# EAGLE design HoverGames_v2 (EAGLE 8.3.2)
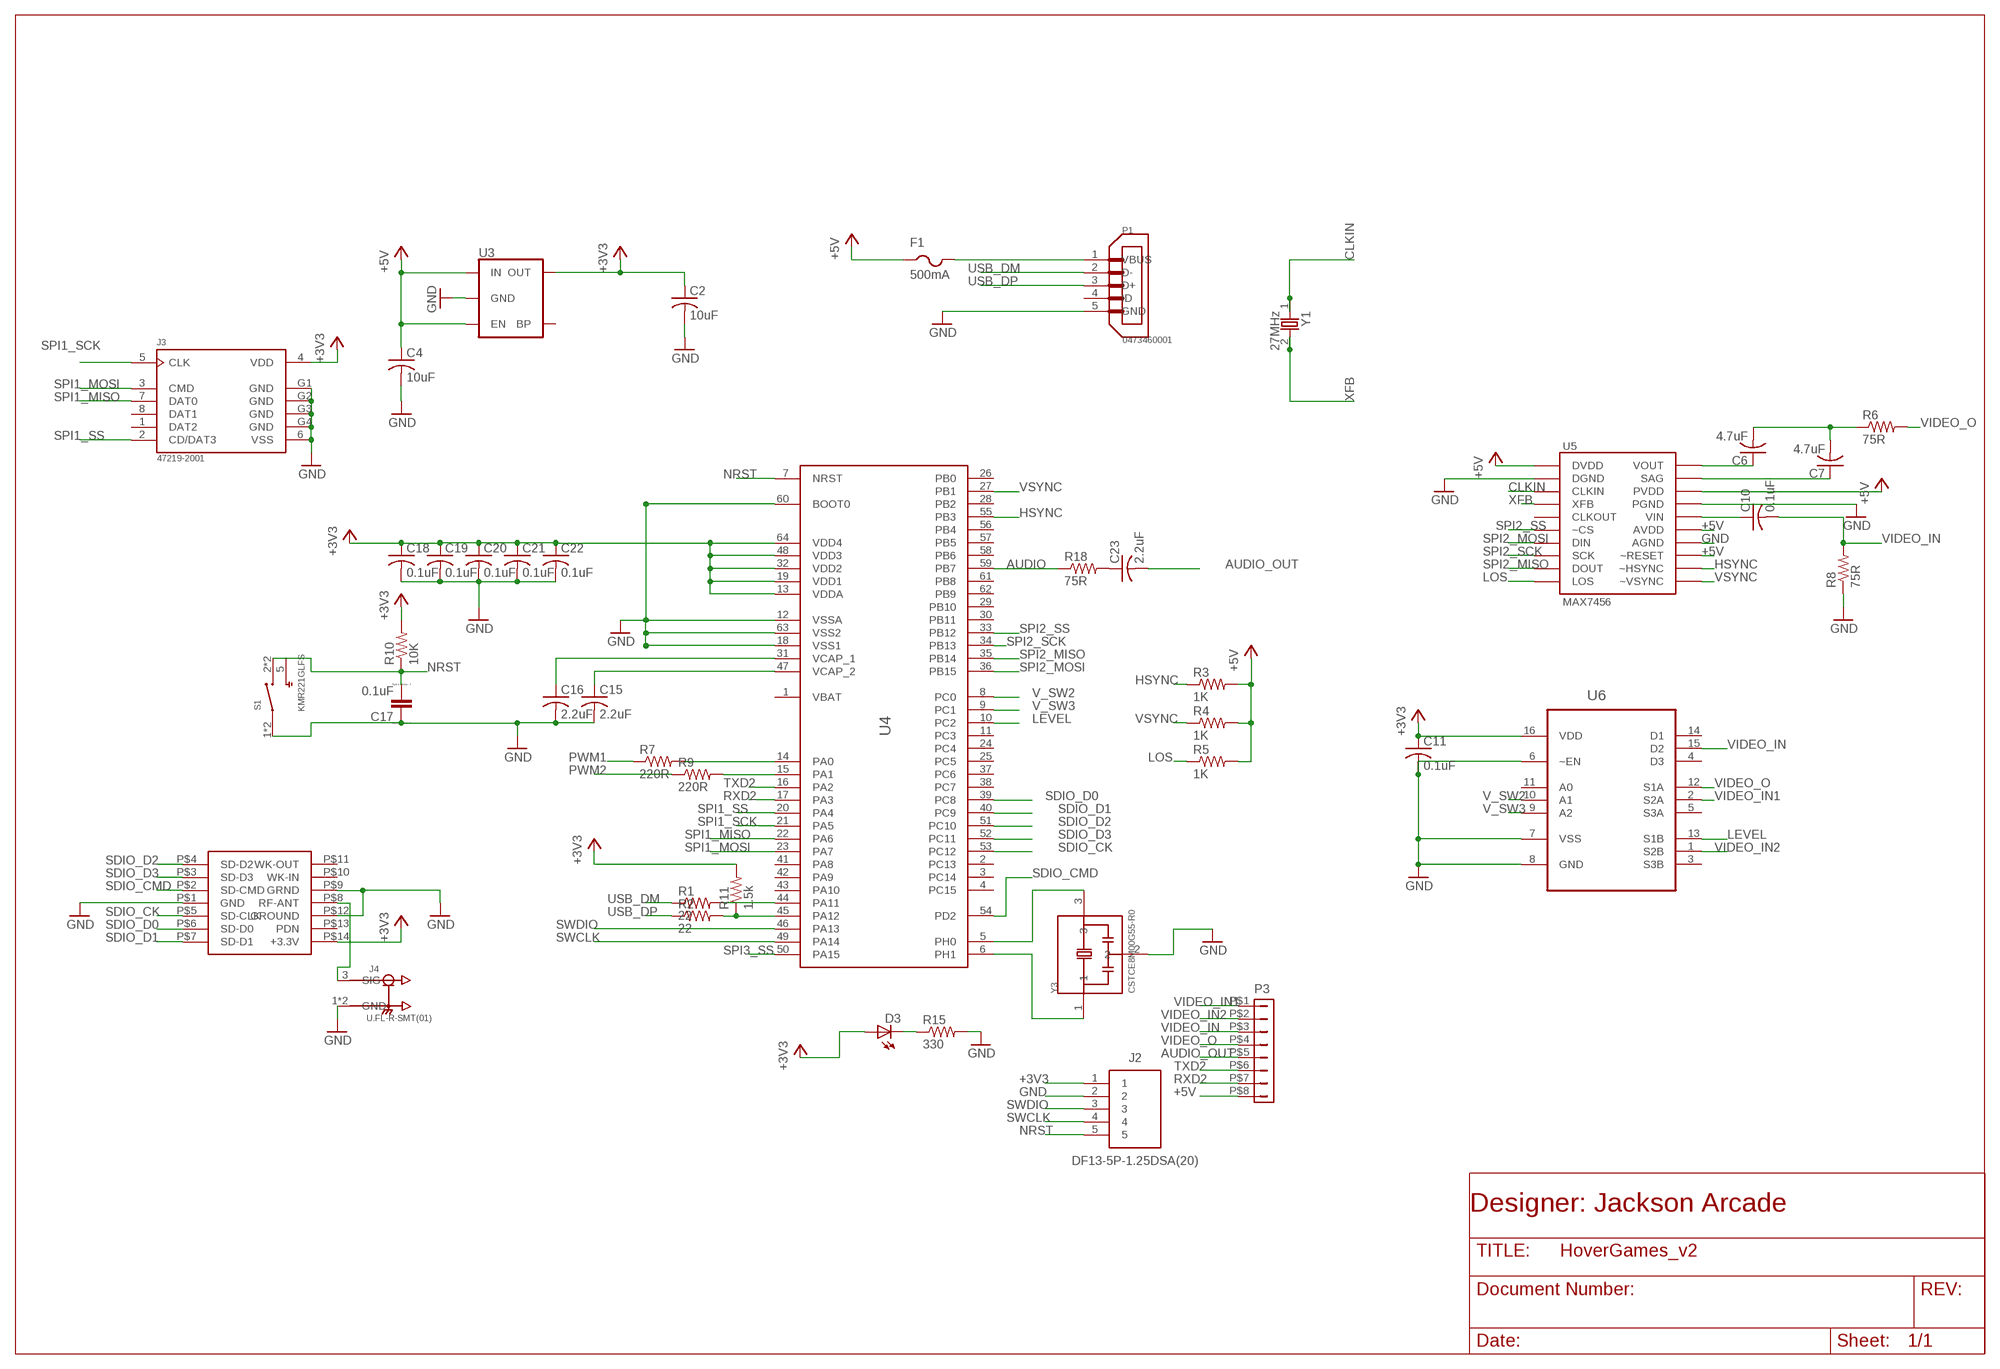
[diagram p0: schematic, sheet 1]

## Parts
C2  10uF  C-USC0402  [C0402]
C4  10uF  C-USC0402  [C0402]
C6  4.7uF  C-USC0402  [C0402]
C7  4.7uF  C-USC0402  [C0402]
C10  0.1uF  C-USC0402  [C0402]
C11  0.1uF  C-USC0402  [C0402]
C15  2.2uF  C-USC0603  [C0603]
C16  2.2uF  C-USC0603  [C0603]
C17  0.1uF  CC0402  [C0402]
C18  0.1uF  C-USC0402  [C0402]
C19  0.1uF  C-USC0402  [C0402]
C20  0.1uF  C-USC0402  [C0402]
C21  0.1uF  C-USC0402  [C0402]
C22  0.1uF  C-USC0402  [C0402]
C23  2.2uF  C-USC0603  [C0603]
D3  LEDCHIP-LED0603  [CHIP-LED0603]
F1  500mA  PTCFUSE-1206  [R1206]
J2  DF13-5P-1.25DSA(20)  [SHDR5W43P0X125_1X5_790X340X460]
J3  47219-2001  [MOLEX_47219-2001]
J4  U.FL-R-SMT(01)  [HRS_U.FL-R-SMT(01)]
P1  0473460001  [MOLEX_0473460001]
P3  DF13-8P-1.25DSA  [DF13-8P-1.25DSA]
R1  22  R-US_R0402  [R0402]
R2  22  R-US_R0402  [R0402]
R3  1K  R-US_R0402  [R0402]
R4  1K  R-US_R0402  [R0402]
R5  1K  R-US_R0402  [R0402]
R6  75R  R-US_R0402  [R0402]
R7  220R  R-US_R0402  [R0402]
R8  75R  R-US_R0402  [R0402]
R9  220R  R-US_R0402  [R0402]
R10  10K  R-US_R0402  [R0402]
R11  1.5k  R-US_R0402  [R0402]
R15  330  R-US_R0402  [R0402]
R18  75R  R-US_R0402  [R0402]
S1  KMR221GLFS  [SW_KMR221GLFS]
U3  V_REG_SPX3819-SOT23-5  [SOT23-5]
U4  STM32F405XXSTM32F405XX  [LQFP64]
U5  MAX7456  [TSSOP28]
U6  ADG733BRUZ  [SOP65P640X120-16N]
U7  88W8801  [88W8801]
Y1  27MHz  ABM3-27.000MHZ-B2-T  [XTAL500X320X130N]
Y3  CSTCE8M00G55-R0  [OSC_CSTCE8M00G55-R0]

## Nets
+3V3: C2.1 C11.1 C18.1 C19.1 C20.1 C21.1 C22.1 D3.A J2.1 J3.4(VDD) R10.2 R11.2 U3.5(OUT) U4.13(VDDA) U4.19(VDD1) U4.32(VDD2) U4.48(VDD3) U4.64(VDD4) U6.16(VDD) U7.P$14(+3.3V)
+5V: C4.1 F1.1 P3.P$8 R3.2 R4.2 R5.2 U3.1(IN) U3.3(EN) U5.3(DVDD) U5.19(~RESET) U5.21(AVDD) U5.24(PVDD)
AUDIO: R18.1 U4.59(PB7)
AUDIO_OUT: C23.2 P3.P$5
CLKIN: U5.5(CLKIN) Y1.1
GND: C2.2 C4.2 C11.2 C15.2 C16.2 C17.1 C18.2 C19.2 C20.2 C21.2 C22.2 J2.2 J3.6(VSS) J3.G1(GND) J3.G2(GND) J3.G3(GND) J3.G4(GND) J4.1(GND) J4.2(GND) P1.5(GND) R8.1 R15.2 S1.1 S1.4 U3.2(GND) U4.12(VSSA) U4.18(VSS1) U4.60(BOOT0) U4.63(VSS2) U5.4(DGND) U5.20(AGND) U5.23(PGND) U6.6(~EN) U6.7(VSS) U6.8(GND) U7.P$1(GND) U7.P$9(GRND) U7.P$12(GROUND) Y3.2
HSYNC: R3.1 U4.55(PB3) U5.18(~HSYNC)
LEVEL: U4.10(PC2) U6.13(S1B)
LOS: R5.1 U5.12(LOS)
N$1: R7.2 U4.14(PA0)
N$2: R9.2 U4.15(PA1)
N$4: C23.1 R18.2
N$5: J4.3(SIG) U7.P$8(RF-ANT)
N$6: C16.1 U4.31(VCAP_1)
N$7: R1.2 U4.44(PA11)
N$8: C15.1 U4.47(VCAP_2)
N$9: R2.2 R11.1 U4.45(PA12)
N$12: C6.1 U5.26(VOUT)
N$13: C7.1 U5.25(SAG)
N$14: C6.2 C7.2 R6.1
N$15: C10.1 U5.22(VIN)
N$16: F1.2 P1.1(VBUS)
N$17: U4.6(PH1) Y3.1
N$18: D3.C R15.1
N$20: U4.5(PH0) Y3.3
NRST: C17.2 J2.5 R10.1 S1.2 S1.3 U4.7(NRST)
PWM1: R7.1
PWM2: R9.1
RXD2: P3.P$7 U4.17(PA3)
SDIO_CK: U4.53(PC12) U7.P$5(SD-CLK)
SDIO_CMD: U4.54(PD2) U7.P$2(SD-CMD)
SDIO_D0: U4.39(PC8) U7.P$6(SD-D0)
SDIO_D1: U4.40(PC9) U7.P$7(SD-D1)
SDIO_D2: U4.51(PC10) U7.P$4(SD-D2)
SDIO_D3: U4.52(PC11) U7.P$3(SD-D3)
SPI1_MISO: J3.7(DAT0) U4.22(PA6)
SPI1_MOSI: J3.3(CMD) U4.23(PA7)
SPI1_SCK: J3.5(CLK) U4.21(PA5)
SPI1_SS: J3.2(CD/DAT3) U4.20(PA4)
SPI2_MISO: U4.35(PB14) U5.11(DOUT)
SPI2_MOSI: U4.36(PB15) U5.9(DIN)
SPI2_SCK: U4.34(PB13) U5.10(SCK)
SPI2_SS: U4.33(PB12) U5.8(~CS)
SPI3_SS: U4.50(PA15)
SWCLK: J2.4 U4.49(PA14)
SWDIO: J2.3 U4.46(PA13)
TXD2: P3.P$6 U4.16(PA2)
USB_DM: P1.2(D-) R1.1
USB_DP: P1.3(D+) R2.1
V_SW2: U4.8(PC0) U6.10(A1)
V_SW3: U4.9(PC1) U6.9(A2)
VIDEO_IN: C10.2 P3.P$3 R8.2 U6.15(D2)
VIDEO_IN1: P3.P$1 U6.2(S2A)
VIDEO_IN2: P3.P$2 U6.1(S2B)
VIDEO_O: P3.P$4 R6.2 U6.12(S1A)
VSYNC: R4.1 U4.27(PB1) U5.17(~VSYNC)
XFB: U5.6(XFB) Y1.2
Unconnected: J3.1(DAT2) J3.8(DAT1) P1.4(ID) S1.5 U3.4(BP) U4.2(PC13) U4.3(PC14) U4.4(PC15) U4.11(PC3) U4.24(PC4) U4.25(PC5) U4.26(PB0) U4.28(PB2) U4.29(PB10) U4.30(PB11) U4.37(PC6) U4.38(PC7) U4.41(PA8) U4.42(PA9) U4.43(PA10) U4.56(PB4) U4.57(PB5) U4.58(PB6) U4.61(PB8) U4.62(PB9) U5.7(CLKOUT) U6.3(S3B) U6.4(D3) U6.5(S3A) U6.11(A0) U6.14(D1) U7.P$10(WK-IN) U7.P$11(WK-OUT) U7.P$13(PDN)

## Notes on the sheet
- Designer: Jackson Arcade

## Power pins joined to a net without a drawn wire
VBAT: U4.1(VBAT)

## Library data of the parts
C2 C4 C6 C7 C11 C15 C16 C18-C23 = rcl:C-US: CAPACITOR, American symbol
C10 = resistor:C-US: CAPACITOR, American symbol
C17 = eagle-ltspice:C: CAPACITOR, European symbol; SPICEMODEL: NONE; SPICEPREFIX: C
D3 = adafruit:LED: LED OSRAM: - CHIPLED LG R971, LG N971, LY N971, LG Q971, LY Q971, LO R971, LY R971 LH N974, LH R974 LS Q976, LO Q976, LY Q976 LO Q996 - Hyper CHIPLED LW Q18S LB Q993, LB Q99A, LB R99A - SideLED LS A670, LO A670, LY A670, LG A670, LP A670 LB A673, LV A673, LT A673, LW A673 LH A674 LY A675 LS A676, LA A676, LO A676, LY A676, LW A676 LS A679, LY A679, LG A679 - Hyper Micro SIDELED® LS Y876, LA Y876, LO Y876, LY Y876 LT Y87S - SmartLED LW L88C, LW L88S LB L89C, LB L89S, LG L890 LS L89K, LO L89K, LY L89K LS L896, LA L896, LO L896, LY L896 - TOPLED LS T670, LO T670, LY T670, LG T670, LP T670 LSG T670, LSP T670, LSY T670, LOP T670, LYG T670 LG T671, LOG T671, LSG T671 LB T673, LV T673, LT T673, LW T673 LH T674 LS T676, LA T676, LO T676, LY T676, LB T676, LH T676, LSB T676, LW T676 LB T67C, LV T67C, LT T67C, LS T67K, LO T67K, LY T67K, LW E67C LS E67B, LA E67B, LO E67B, LY E67B, LB E67C, LV E67C, LT E67C LW T67C LS T679, LY T679, LG T679 LS T770, LO T770, LY T770, LG T770, LP T770 LB T773, LV T773, LT T773, LW T773 LH T774 LS E675, LA E675, LY E675, LS T675 LS T776, LA T776, LO T776, LY T776, LB T776 LHGB T686 LT T68C, LB T68C - Hyper Mini TOPLED® LB M676 - Mini TOPLED Santana® LG M470 LS M47K, LO M47K, LY M47K Source: http://www.osram.convergy.de/
F1 = adafruit:PTCFUSE: PTC fuses, resettable thermistors
J2 = DF13-5P-1.25DSA(20):DF13-5P-1.25DSA(20): Hirose DF13 Series, 1.25mm Pitch 5 Way 1 Row Straight PCB Header, Solder Termination, 1A <https://componentsearchengine.com/Images/3/DF13-5P-1.25DSA%2820%29.jpg> Source: Datasheet <https://www.hirose.com/product/en/download_file/key_name/DF13-5P-1.25DSA(20)/category/Drawing (2D)/doc_file_id/38127/?file_category_id=6&item_id=05360104720&is_series=>; DESCRIPTION: Hirose DF13 Series, 1.25mm Pitch 5 Way 1 Row Straight PCB Header, Solder Termination, 1A; HEIGHT: 4.6mm; MANUFACTURER_NAME: Hirose; MANUFACTURER_PART_NUMBER: DF13-5P-1.25DSA(20); RS_PART_NUMBER: 5037912P; SUPPLIER_NAME: RS
J3 = 47219-2001:47219-2001: 1.10mm Pitch microSD Card Connector, Hinge Type, Lead-Free http://www.snapeda.com/parts/47219-2001/Molex%20/%20Waldom/view-part/#; AVAILABILITY: Good; DESCRIPTION: Conn Micro SD Card SKT 8 POS 1.1mm Solder RA SMD 0.5A/Contact Embossed T/R; MF: Molex; MP: 47219-2001; PACKAGE: None; PRICE: 0.62 USD
J4 = U.FL-R-SMT_01_:U.FL-R-SMT(01): U.FL Series 6 Ghz 50 Ohm Ultra-small SMT Coaxial Cable Receptacle; AVAILABILITY: Good; DESCRIPTION: U.FL Series 6 Ghz 50 Ohm Ultra-small SMT Coaxial Cable Receptacle; MF: Hirose; MP: U.FL-R-SMT(01); PACKAGE: None; PRICE: 0.82 USD
P1 = 0473460001:0473460001: Conn Micro USB Type B RCP 5 POS 0.65mm Solder RA SMD 5 Terminal 1 Port T/R; AVAILABILITY: Good; DESCRIPTION: DEK 5 FW 1-50. Terminal markers, Card, 5 x 5 mm, Polyamide, Colour: White GTIN (EAN): 4008190135157; MF: Weidmuller; MP: 0473460001; PACKAGE: None; PRICE: 2.87 USD
P3 = con-hirose-df13:DF13-8P-1.25: DF13-8P 1.25mm Pitch Miniature Crimping Connector.
R1-R7 R9-R11 R15 R18 = rcl:R-US_: RESISTOR, American symbol
R8 = resistor:R-US_: RESISTOR, American symbol
S1 = KMR221GLFS:KMR221GLFS: Switch Tactile N.O. SPST Button Gull Wing 0.05A 32VDC 1VA 200000Cycles 2N SMD Automotive T/R; AVAILABILITY: Good; DESCRIPTION: Switch Tactile N.O. SPST Button Gull Wing 0.05A 32VDC 1VA 200000Cycles 2N SMD Automotive T/R; MF: C&K Components; MP: KMR221GLFS; PACKAGE: None; PRICE: 0.27 USD
U3 = SparkFun-IC-Power:V_REG_SPX3819: SPX3819 Voltage Regulator 3.3V 500mA, 16V input Datasheet <https://www.exar.com/content/document.ashx?id=22106> SparkFun Products: SparkFun Serial Controlled Motor Driver <https://www.sparkfun.com/products/13911>; PROD_ID: VREG-13321; VALUE: SPX3819M5_3_3
U4 = stm32f:STM32F405XX: Features • Core: ARM 32-bit Cortex™-M4 CPU with FPU, Adaptive real-time accelerator (ART Accelerator™) allowing 0-wait state execution from Flash memory, frequency up to 168 MHz, memory protection unit, 210 DMIPS/ 1.25 DMIPS/MHz (Dhrystone 2.1), and DSP instructions • Memories – Up to 1 Mbyte of Flash memory – Up to 192+4 Kbytes of SRAM including 64- Kbyte of CCM (core coupled memory) data RAM – Flexible static memory controller supporting Compact Flash, SRAM, PSRAM, NOR and NAND memories • LCD parallel interface, 8080/6800 modes • Clock, reset and supply management – 1.8 V to 3.6 V application supply and I/Os – POR, PDR, PVD and BOR – 4-to-26 MHz crystal oscillator – Internal 16 MHz factory-trimmed RC (1% accuracy) – 32 kHz oscillator for RTC with calibration – Internal 32 kHz RC with calibration • Low power – Sleep, Stop and Standby modes – VBAT supply for RTC, 20×32 bit backup registers + optional 4 KB backup SRAM • 3×12-bit, 2.4 MSPS A/D converters: up to 24 channels and 7.2 MSPS in triple interleaved mode • 2×12-bit D/A converters • General-purpose DMA: 16-stream DMA controller with FIFOs and burst support • Up to 17 timers: up to twelve 16-bit and two 32- bit timers up to 168 MHz, each with up to 4 IC/OC/PWM or pulse counter and quadrature (incremental) encoder input • Debug mode – Serial wire debug (SWD) & JTAG interfaces – Cortex-M4 Embedded Trace Macrocell™ • Up to 140 I/O ports with interrupt capability – Up to 136 fast I/Os up to 84 MHz – Up to 138 5 V-tolerant I/Os • Up to 15 communication interfaces – Up to 3 × I2C interfaces (SMBus/PMBus) – Up to 4 USARTs/2 UARTs (10.5 Mbit/s, ISO 7816 interface, LIN, IrDA, modem control) – Up to 3 SPIs (42 Mbits/s), 2 with muxed full-duplex I2S to achieve audio class accuracy via internal audio PLL or external clock – 2 × CAN interfaces (2.0B Active) – SDIO interface • Advanced connectivity – USB 2.0 full-speed device/host/OTG controller with on-chip PHY – USB 2.0 high-speed/full-speed device/host/OTG controller with dedicated DMA, on-chip full-speed PHY and ULPI – 10/100 Ethernet MAC with dedicated DMA: supports IEEE 1588v2 hardware, MII/RMII • 8- to 14-bit parallel camera interface up to 54 Mbytes/s • True random number generator • CRC calculation unit • 96-bit unique ID • RTC: subsecond accuracy, hardware calendar
U5 = SparkFun-Retired:MAX7456: Monochrome NTSC/PAL on-screen display generator (SPI)
U6 = Analog Devices_By_element14_Batch_1:ADG733BRUZ: SPDT Switches; MPN: ADG733BRUZ; OC_FARNELL: 1699597; OC_NEWARK: 59K1571; PACKAGE: TSSOP-16; SUPPLIER: ANALOG DEVICES
U7 = 88w8801:88W8801
Y1 = ABM3-27.000MHZ-B2-T:ABM3-27.000MHZ-B2-T: Crystals 12MHz 18pF 30ppm -40C +85C; AVAILABILITY: Good; DESCRIPTION: Crystal 27MHz ?Ø¢Â±20ppm (Tol) ?Ø¢Â±50ppm (Stability) 18pF FUND 50Ohm 2-Pin CSMD T/R; MF: Abracon; MP: ABM3-27.000MHZ-B2-T; PACKAGE: SMD-2 Abracon; PRICE: 0.59 USD
Y3 = CSTCE8M00G55-R0:CSTCE8M00G55-R0: SMD Crystal 8MHz -0.3%-150R; AVAILABILITY: Good; DESCRIPTION: Ceramic Resonator 8MHz ??0.5% (Tol) ??0.2% (Stability) 33pF 40Ohm 3-Pin CSMD T/R; MF: Murata; MP: CSTCE8M00G55-R0; PACKAGE: SMD-3 Murata; PRICE: 0.27 USD

## Board
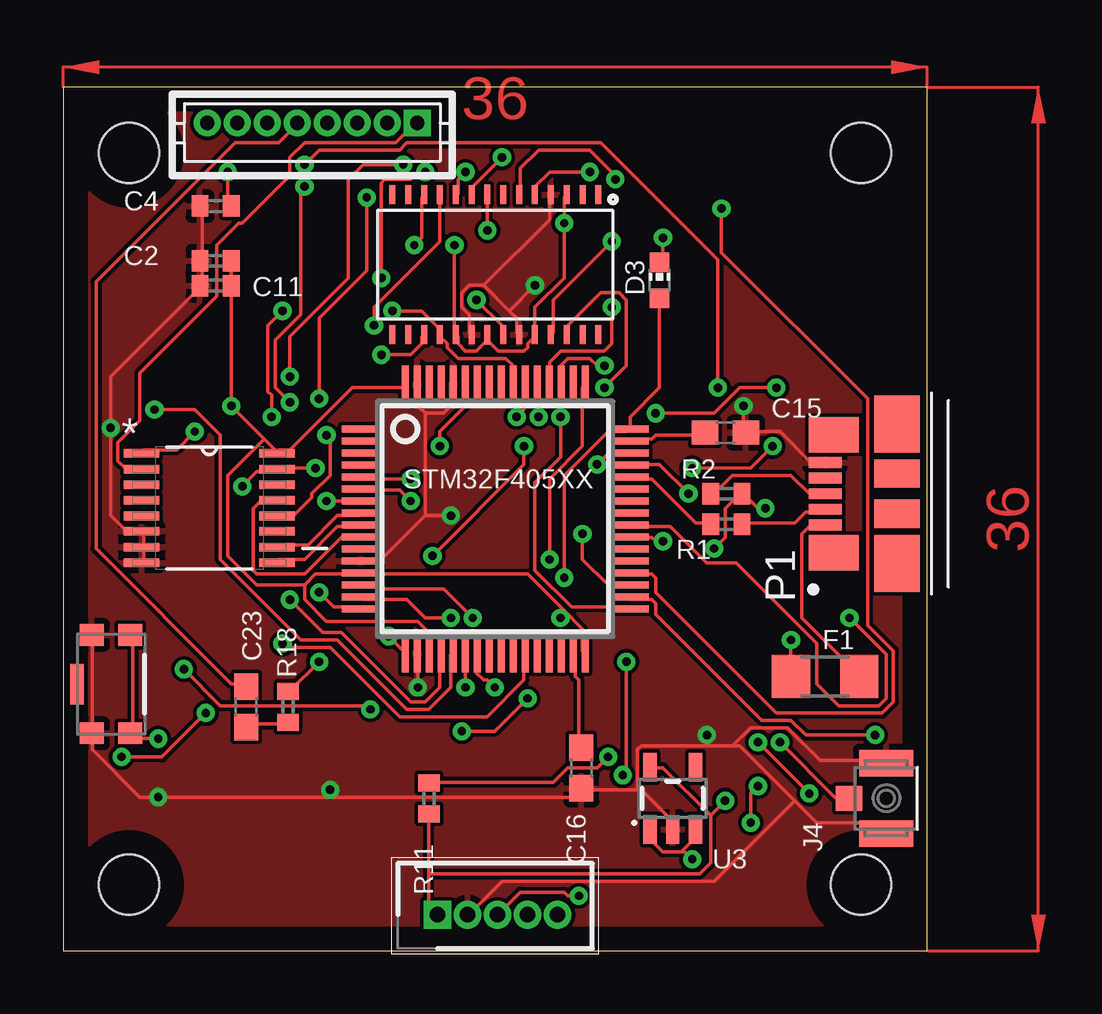
[diagram p1: board, top side]
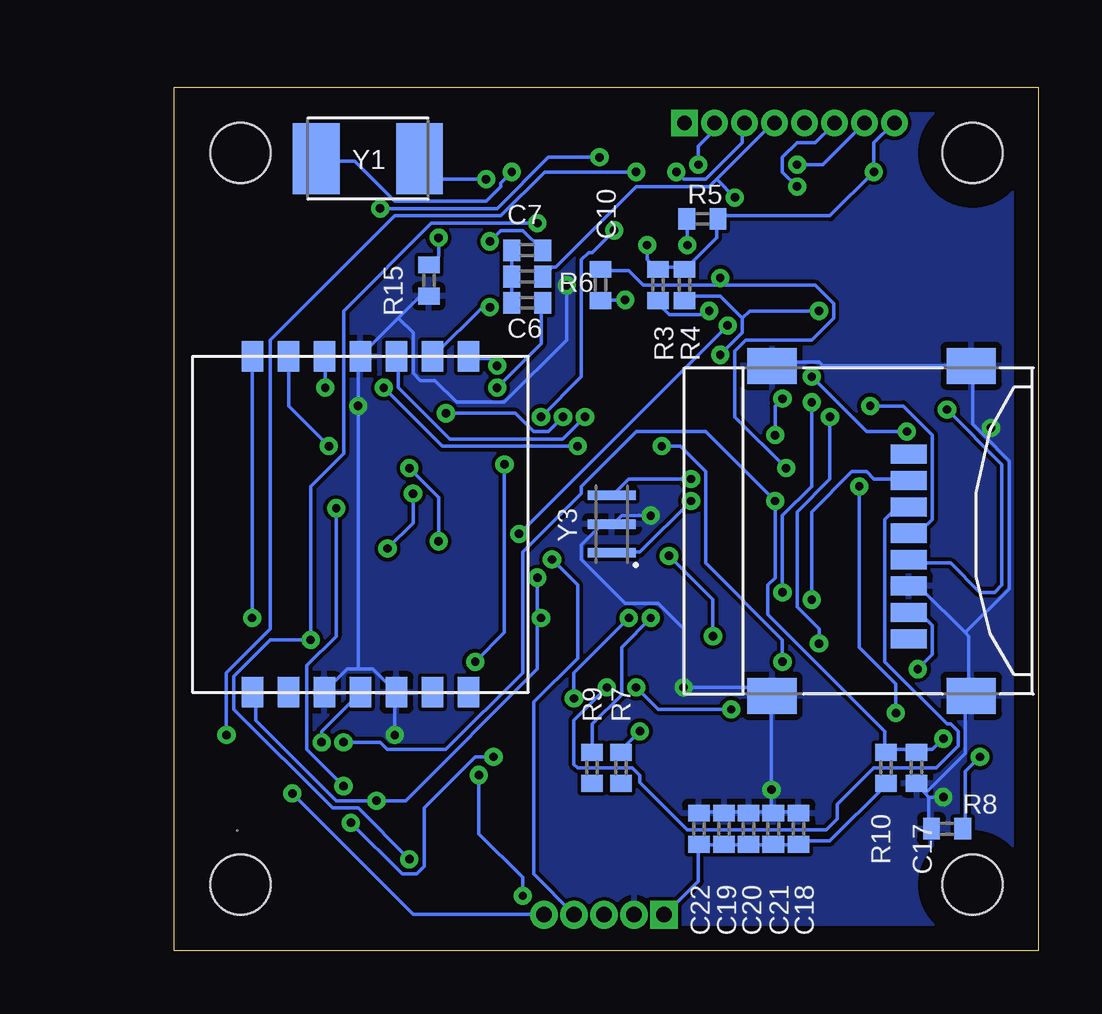
[diagram p2: board, bottom side, seen from below]

Size 36 x 36 mm. Coordinates in mm from the lower left corner, seen from the top.
Outline: 0,0 36,0 36,36 0,36 0,0
Copper layers (1*16): Top 0.035mm / dielectric 1.5mm / Bottom 0.035mm
Design rules "default": minimum track width 6mil, minimum drill 0.35mm, track to track 6mil, track to pad 6mil, pad to pad 6mil, via to via 6mil, smd to smd 6mil, copper to edge 40mil, drill to drill 6mil, minimum pad ring 10mil, minimum via ring 8mil, stop-mask expansion 4mil, vias tented up to drill 0mil, thermal gap 10mil
Holes 2.5 mm at 2.75,2.75 33.25,2.75 33.25,33.25 2.75,33.25

### Footprints (pad centres in the part's own frame; a part is rotated, then mirrored left to right if it is on the bottom)
C0402 = smd 0.7 x 0.9: 1 -0.65,0; 2 0.65,0
C0603 = smd 1.1 x 1: 1 -0.85,0; 2 0.85,0
CHIP-LED0603 = smd 0.8 x 0.8: A 0,-0.75; C 0,0.75
R1206 = smd 1.6 x 1.803: 1 -1.422,0; 2 1.422,0
SHDR5W43P0X125_1X5_790X340X460 = drill 0.65 pad 1.05 square: 1 0,0 | drill 0.65 pad 1.05: 2 1.25,0; 3 2.5,0; 4 3.75,0; 5 5,0
MOLEX_47219-2001 = smd 0.8 x 1.5: 1 3.2,-2.1; 2 2.1,-2.1; 3 1,-2.1; 4 -0.1,-2.1; 5 -1.2,-2.1; 6 -2.3,-2.1; 7 -3.4,-2.1; 8 -4.5,-2.1 | smd 1.5 x 2.05: G1 6.875,-4.7; G2 6.875,3.6; G3 -6.875,3.6; G4 -6.875,-4.7
HRS_U.FL-R-SMT(01) = smd 1.1 x 2.25: 1 -1.475,0; 2 1.475,0 | smd 1.05 x 1.1: 3 0,-1.55
MOLEX_0473460001 = smd 0.45 x 1.38: 1 -1.3,0; 2 -0.65,0; 3 0,0; 4 0.65,0; 5 1.3,0 | smd 1.475 x 2.1: P1 -2.462,-0.36; P2 2.462,-0.36 | smd 2.375 x 1.9: P3 -2.913,-2.99; P6 2.913,-2.99 | smd 1.175 x 1.9: P4 -0.838,-2.99; P5 0.838,-2.99
DF13-8P-1.25DSA = drill 0.6 pad 1.016 square: P$1 4.375,0 | drill 0.6 pad 1.016: P$2 3.125,0; P$3 1.875,0; P$4 0.625,0; P$5 -0.625,0; P$6 -1.875,0; P$7 -3.125,0; P$8 -4.375,0
R0402 = smd 0.7 x 0.9: 1 -0.65,0; 2 0.65,0
SW_KMR221GLFS = smd 0.9 x 1: 1 -2.05,0.8; 2 -2.05,-0.8; 3 2.05,-0.8; 4 2.05,0.8 | smd 1.7 x 0.55: 5 0,1.425
SOT23-5 = smd 0.55 x 1.2: 1 -0.95,-1.3; 2 0,-1.3; 3 0.95,-1.3; 4 0.95,1.3; 5 -0.95,1.3
LQFP64 = smd 1.6 x 0.3: 1 -5.6,3.75; 2 -5.6,3.25; 3 -5.6,2.75; 4 -5.6,2.25; 5 -5.6,1.75; 6 -5.6,1.25; 7 -5.6,0.75; 8 -5.6,0.25; 9 -5.6,-0.25; 10 -5.6,-0.75; 11 -5.6,-1.25; 12 -5.6,-1.75; 13 -5.6,-2.25; 14 -5.6,-2.75; 15 -5.6,-3.25; 16 -5.6,-3.75; 33 5.6,-3.75; 34 5.6,-3.25; 35 5.6,-2.75; 36 5.6,-2.25; 37 5.6,-1.75; 38 5.6,-1.25; 39 5.6,-0.75; 40 5.6,-0.25; 41 5.6,0.25; 42 5.6,0.75; 43 5.6,1.25; 44 5.6,1.75; 45 5.6,2.25; 46 5.6,2.75; 47 5.6,3.25; 48 5.6,3.75 | smd 0.3 x 1.6: 17 -3.75,-5.6; 18 -3.25,-5.6; 19 -2.75,-5.6; 20 -2.25,-5.6; 21 -1.75,-5.6; 22 -1.25,-5.6; 23 -0.75,-5.6; 24 -0.25,-5.6; 25 0.25,-5.6; 26 0.75,-5.6; 27 1.25,-5.6; 28 1.75,-5.6; 29 2.25,-5.6; 30 2.75,-5.6; 31 3.25,-5.6; 32 3.75,-5.6; 49 3.75,5.6; 50 3.25,5.6; 51 2.75,5.6; 52 2.25,5.6; 53 1.75,5.6; 54 1.25,5.6; 55 0.75,5.6; 56 0.25,5.6; 57 -0.25,5.6; 58 -0.75,5.6; 59 -1.25,5.6; 60 -1.75,5.6; 61 -2.25,5.6; 62 -2.75,5.6; 63 -3.25,5.6; 64 -3.75,5.6
TSSOP28 = smd 0.8 x 0.25: 1 -2.921,4.623; 2 -2.921,3.962; 3 -2.921,3.302; 4 -2.921,2.642; 5 -2.921,1.981; 6 -2.921,1.321; 7 -2.921,0.66; 8 -2.927,0; 9 -2.921,-0.66; 10 -2.921,-1.321; 11 -2.921,-1.981; 12 -2.921,-2.642; 13 -2.921,-3.302; 14 -2.921,-3.962; 15 2.921,-3.962; 16 2.921,-3.302; 17 2.921,-2.642; 18 2.921,-1.981; 19 2.921,-1.321; 20 2.921,-0.66; 21 2.927,0; 22 2.921,0.66; 23 2.921,1.321; 24 2.921,1.981; 25 2.921,2.642; 26 2.921,3.302; 27 2.921,3.962; 28 2.921,4.623
SOP65P640X120-16N = smd 1.473 x 0.356: 1 -2.819,2.286; 2 -2.819,1.626; 3 -2.819,0.965; 4 -2.819,0.33; 5 -2.819,-0.33; 6 -2.819,-0.965; 7 -2.819,-1.626; 8 -2.819,-2.286; 9 2.819,-2.286; 10 2.819,-1.626; 11 2.819,-0.965; 12 2.819,-0.33; 13 2.819,0.33; 14 2.819,0.965; 15 2.819,1.626; 16 2.819,2.286
88W8801 = smd 1.27 x 0.9: P$1 -7,0; P$2 -7,1.5; P$3 -7,3; P$4 -7,4.5; P$5 -7,-1.5; P$6 -7,-3; P$7 -7,-4.5; P$8 7,0; P$9 7,1.5; P$10 7,3; P$11 7,4.5; P$12 7,-1.5; P$13 7,-3; P$14 7,-4.5
XTAL500X320X130N = smd 1.95 x 2.95: 1 -2.15,0; 2 2.15,0
OSC_CSTCE8M00G55-R0 = smd 0.4 x 2: 1 -1.2,0; 2 0,0; 3 1.2,0

### Placement (x,y rotation side)
C2  6.35,28.76 180 top
C4  6.35,31.04 180 top
C6  21.3,27 180 bottom
C7  21.3,29.2 180 bottom
C10  18.25,27.75 90 bottom
C11  6.35,27.72 180 top
C15  27.6,21.59 0 top
C16  21.59,7.62 270 top
C17  5.08,7.62 90 bottom
C18  10,5.08 90 bottom
C19  13.1,5.08 90 bottom
C20  12.08,5.08 90 bottom
C21  11.05,5.08 90 bottom
C22  14.15,5.08 90 bottom
C23  7.62,10.16 90 top
D3  24.85,27.94 0 top
F1  31.75,11.43 0 top
J2  15.6,1.5 0 top
J3  7.5,17.5 90 bottom
J4  34.29,6.35 270 top
P1  31.75,19.05 90 top
P3  10.38,34.5 0 top
R1  27.64,17.78 180 top
R2  27.64,19.05 0 top
R3  15.85,27.75 90 bottom
R4  14.75,27.75 90 bottom
R5  14,30.5 0 bottom
R6  21.3,28.1 0 bottom
R7  17.4,7.62 90 bottom
R8  3.81,5.08 0 bottom
R9  18.6,7.62 90 bottom
R10  6.35,7.62 270 bottom
R11  15.24,6.35 270 top
R15  25.4,27.94 270 bottom
R18  9.37,10.16 270 top
S1  2,11.11 90 top
U3  25.4,6.35 0 top
U4  18,18 0 top
U5  17.68,28.6 270 top
U6  6.09,18.45 0 top
U7  28.25,17.77 270 bottom
Y1  27.94,33.02 0 bottom
Y3  17.78,17.78 90 bottom

### Tracks (layer width: path | path; a pad name or v marks a point on that pad's centre or on a via)
+3V3  (via drill 0.35)
  Top 0.152: 10.06,15.24 10.52,15.7 12.34,15.7 U4.13 12.5,15.7 19.36,15.7 20.88,14.17 | 10.06,15.24 10.06,14.63 10.97,13.72 14.78,13.72 15.24,13.26 15.24,12.5 U4.19 | 20.88,14.17 21.64,13.41 21.64,12.5 U4.32 | C2.1 7.01,28.65 7.01,27.74 C11.1 7.01,27.58 v7.01,22.71 8.38,21.34 | 8.38,21.34 8.84,20.88 U6.16 8.99,20.88 9.45,20.88 12.04,23.47 14.17,23.47 U4.64 | 10.06,15.24 8.08,15.24 6.86,16.46 6.86,19.81 8.38,21.34 | D3.A 24.84,27.13 24.84,23.47 23.62,22.25 23.62,21.79 U4.48 23.47,21.64 22.71,21.64 20.88,19.81 v20.88,15.54 | 15.24,3.2 15.24,1.83 15.54,1.52 J2.1 | 15.24,3.2 R11.2 | 26.98,5.64 24.99,7.62 24.54,7.62 U3.5 | 26.98,5.64 26.98,3.66 26.52,3.2 15.24,3.2 | 26.98,5.64 v27.58,6.25 | 20.88,14.17 20.88,14.02 v20.73,13.87
  Bottom 0.152: v7.01,22.71 5.64,22.71 4.42,21.49 4.42,17.98 4.88,17.53 5.33,17.53 J3.4 | R10.2 6.4,6.86 8.69,4.57 9.91,4.57 C18.1 10.06,4.42 10.97,4.42 C21.1 11.12,4.42 12.04,4.42 C20.1 12.19,4.42 12.95,4.42 C19.1 14.02,4.42 C22.1 14.17,4.42 14.17,2.9 15.54,1.52 J2.1 | U7.P$14 32.61,10.67 32.61,9.6 29.26,6.25 v27.58,6.25 26.36,6.25 20.88,11.73 20.88,13.87 | 20.88,13.87 v20.88,15.54 | 20.88,13.87 v20.73,13.87
+5V  (via drill 0.35)
  Top 0.152: 25.76,4.12 24.99,4.12 24.54,4.57 24.54,5.03 U3.1 | 25.76,4.12 26.21,4.57 26.21,5.03 U3.3 | v30.33,12.95 F1.1 | v26.21,3.81 25.91,4.12 25.76,4.12 | F1.1 | 17.68,25.45 17.22,24.99 16.76,24.99 16.46,25.3 16.46,25.6 U5.19 16.31,25.76 v16.31,29.41 | 17.68,25.45 17.68,25.6 U5.21 17.68,25.45 | 17.68,25.45 18.14,24.99 19.2,24.99 19.36,25.15 19.36,25.3 19.66,25.6 U5.24 19.66,25.76 19.66,26.82 20.88,28.04 v20.88,30.33 20.88,31.39 U5.3 | v6.86,32.46 6.86,31.09 C4.1
  Bottom 0.152: v26.21,3.81 28.35,5.94 29.41,5.94 33.53,10.06 33.53,11.43 32,12.95 v30.33,12.95 30.33,19.36 28.96,20.73 28.96,26.67 25.3,30.33 v20.88,30.33 | P3.P$8 6.1,34.44 6.86,33.68 v6.86,32.46 8.69,30.63 13.26,30.63 R5.2 13.41,30.48 13.41,29.72 14.63,28.5 R4.2 14.78,28.5 15.85,28.5 R3.2 16,28.5 16.31,28.8 v16.31,29.41
AUDIO  (via drill 0.35)
  Top 0.152: v10.67,12.04 9.45,10.82 R18.1 | v15.7,21.03 15.7,21.64 16.76,22.71 16.76,23.47 U4.59
  Bottom 0.152: v10.67,12.04 10.67,12.95 13.87,16.15 13.87,19.96 14.94,21.03 v15.7,21.03
AUDIO_OUT
  Top 0.152: C23.2 7.62,11.12 7.01,11.12 1.37,16.76 1.37,27.89 7.16,33.68 8.99,33.68 9.75,34.44 P3.P$5
CLKIN  (via drill 0.35)
  Top 0.152: v21.95,32.46 20.27,32.46 19.66,31.85 19.66,31.55 U5.5
  Bottom 0.152: v21.95,32.46 22.4,32 22.4,31.85 23.01,31.24 26.82,31.24 28.5,32.92 30.02,32.92 Y1.1
GND  (via drill 0.35)
  Top 0.152: U6.8 3.35,16.31 3.35,16.76 U6.7 3.35,16.92 3.35,17.37 U6.6 3.2,17.53 2.59,17.53 1.98,18.14 v1.98,21.79 1.98,23.93 5.64,27.58 C11.2 5.79,27.74 5.79,28.65 C2.2 5.79,28.8 5.79,30.94 C4.2 | 17.53,27.74 16.92,27.74 16.61,27.43 16.61,26.82 16.92,26.52 16.92,25.76 U5.20 | 18.59,26.67 18.9,26.36 18.9,25.76 U5.23 | 18.59,26.67 17.53,27.74 | 17.53,27.74 20.27,30.48 20.27,31.39 U5.4 | P1.5 31.7,20.42 31.09,20.42 29.87,21.64 28.5,21.64 C15.2 28.35,21.64 v28.35,22.71 | v19.66,27.74 18.59,26.67 | 15.09,18.14 13.26,16.31 12.5,16.31 U4.12 | 15.09,22.4 15.09,18.14 | 15.09,22.4 14.78,22.71 14.78,23.47 U4.63 | 15.09,22.4 15.85,22.4 16.15,22.71 16.15,23.47 U4.60 | v14.78,10.97 14.78,12.34 U4.18 | v16.15,18.14 15.09,18.14 | S1.4 1.22,13.11 1.22,9.14 S1.1 1.22,8.99 1.22,8.38 3.2,6.4 v3.96,6.4 11.12,6.4 | 23.93,6.71 24.08,6.71 25.3,5.49 25.3,5.18 U3.2 | 23.93,6.71 21.64,6.71 C16.2 21.49,6.71 21.18,6.4 11.12,6.4 | 30.48,6.25 28.19,8.53 27.89,8.53 | 30.48,6.25 31.39,5.33 33.83,5.33 J4.2 | 26.82,8.53 24.08,8.53 23.93,8.38 23.93,6.71 | 26.82,8.53 27.89,8.53 | 27.89,8.53 28.65,9.3 30.18,9.3 31.55,7.92 34.29,7.92 J4.1 | 30.48,6.25 27.13,2.9 18.29,2.9 16.92,1.52 J2.2 | 11.12,6.4 v11.12,6.71 | 26.82,8.53 v26.82,8.99
  Bottom 0.152: J3.G2 10.97,24.38 10.82,24.54 9.14,24.54 8.99,24.38 2.9,24.38 J3.G1 2.74,24.23 2.74,21.95 2.29,21.49 | 4.57,6.4 4.57,5.18 R8.1 | 4.72,6.55 5.03,6.86 C17.1 | 4.72,6.55 4.57,6.4 | 3.05,13.26 2.9,13.11 2.9,10.67 J3.G4 2.9,10.52 3.05,10.36 3.05,8.23 4.72,6.55 | 3.05,13.26 4.88,15.09 5.33,15.09 J3.6 | 2.29,21.49 1.22,20.42 1.22,15.09 3.05,13.26 | 2.29,21.49 v1.98,21.79 | 28.35,11.73 28.8,11.73 29.72,10.82 U7.P$12 | 28.35,11.73 27.74,11.73 26.82,10.82 U7.P$9 26.82,10.67 v26.82,8.99 | 26.67,26.36 28.19,24.84 U7.P$1 28.35,24.69 v28.35,22.71 28.35,11.73 | 26.67,26.36 25.76,27.28 25.45,27.28 R15.2 | v19.66,27.74 19.66,25.45 22.25,22.86 24.23,22.86 25.15,23.77 25.76,23.77 26.06,24.08 26.06,25.76 26.67,26.36 | C18.2 10.06,5.79 10.97,5.79 C21.2 11.12,5.79 | C22.2 14.02,5.79 13.11,5.79 C19.2 12.95,5.79 12.19,5.79 C20.2 12.04,5.79 11.12,5.79 | 11.12,5.79 v11.12,6.71 11.12,10.52 J3.G3 11.12,10.67 11.43,10.97 v14.78,10.97 14.78,13.41 15.85,14.48 17.22,14.48 19.05,16.31 19.05,16.92 18.29,17.68 17.83,17.68 Y3.2 17.68,17.83 17.37,18.14 v16.15,18.14 | v3.96,6.4 4.57,6.4
  pour Top: 0,35.56 0,0 35.56,0 35.56,35.56
  pour Bottom: 0,35.56 0,0 35.56,0 35.56,35.56
HSYNC  (via drill 0.35)
  Top 0.152: U4.55 18.75,23.62 18.75,24.38 18.44,24.69 16.46,24.69 16,25.15 16,25.3 15.7,25.6 U5.18 15.7,25.76 15.7,25.91 14.94,26.67 v13.72,26.67
  Bottom 0.152: v13.72,26.67 13.87,26.52 15.39,26.52 15.85,26.98 R3.1
LEVEL
  Top 0.152: U6.13 8.84,18.75 8.23,18.75 7.92,18.44 7.92,15.85 8.08,15.7 10.06,15.7 11.58,17.22 12.34,17.22 U4.10
LOS  (via drill 0.35)
  Top 0.152: v14.63,29.41 14.94,29.72 14.94,31.39 U5.12
  Bottom 0.152: v14.63,29.41 14.63,30.48 R5.1
N$1  (via drill 0.35)
  Top 0.152: v16.61,9.14 17.98,9.14 v19.36,10.52 | v17.07,13.87 15.85,15.09 13.41,15.09 13.26,15.24 12.5,15.24 U4.14
  Bottom 0.152: v16.61,9.14 17.37,8.38 R7.2 | v19.36,10.52 19.36,11.58 v17.07,13.87
N$2  (via drill 0.35)
  Top 0.152: v16.15,13.87 15.09,13.87 14.33,14.63 12.5,14.63 U4.15
  Bottom 0.152: v16.15,13.87 17.37,12.65 17.37,10.67 18.59,9.45 18.59,8.38 R9.2
N$4
  Top 0.152: R18.2 9.3,9.45 7.62,9.45 C23.1
N$5  (via drill 0.35)
  Top 0.152: v29.87,8.69 32.16,6.4 32.61,6.4 J4.3
  Bottom 0.152: v29.87,8.69 29.87,9.14 28.35,10.67 U7.P$8
N$6
  Top 0.152: C16.1 21.49,8.53 21.49,11.28 21.34,11.43 21.34,12.34 U4.31
N$7
  Top 0.152: R1.2 26.98,17.83 26.36,17.83 24.54,19.66 23.62,19.66 U4.44
N$8
  Top 0.152: C15.1 26.67,21.49 24.69,21.49 24.54,21.34 23.62,21.34 U4.47
N$9  (via drill 0.35)
  Top 0.152: v22.71,8.08 22.25,7.62 21.03,7.62 20.42,7.01 R11.1 | v28.65,5.33 28.65,6.55 v28.96,6.86 | v29.26,18.44 28.96,18.44 28.35,19.05 R2.2 28.19,19.05 27.58,18.44 27.58,17.22 v27.13,16.76 | v26.06,19.05 24.84,20.27 23.62,20.27 U4.45
  Bottom 0.152: v22.71,8.08 23.47,8.08 25.6,5.94 25.6,3.5 25.91,3.2 26.52,3.2 v28.65,5.33 | v28.96,6.86 30.48,8.38 30.48,11.89 29.26,13.11 v29.26,18.44 | v26.06,19.05 26.06,17.83 v27.13,16.76
N$12  (via drill 0.35)
  Top 0.152: v22.55,23.47 23.47,24.38 23.47,27.13 23.16,27.43 22.4,27.43 21.03,26.06 21.03,25.76 U5.26
  Bottom 0.152: v22.55,23.47 20.73,25.3 20.73,26.98 C6.1
N$13  (via drill 0.35)
  Top 0.152: v22.86,29.57 20.42,27.13 20.42,25.76 U5.25
  Bottom 0.152: v22.86,29.57 22.4,30.02 21.49,30.02 20.73,29.26 C7.1
N$14
  Bottom 0.152: C6.2 21.95,27.13 21.95,28.04 R6.1 21.95,28.19 21.95,29.11 C7.2
N$15  (via drill 0.35)
  Top 0.152: v17.22,27.13 18.29,26.06 18.29,25.76 U5.22
  Bottom 0.152: v17.22,27.13 18.14,27.13 C10.1
N$16
  Top 0.152: P1.1 31.7,17.68 31.09,17.68 30.79,17.37 30.79,13.87 33.22,11.43 F1.2
N$17  (via drill 0.35)
  Top 0.152: v14.48,18.75 14.02,19.2 12.5,19.2 U4.6
  Bottom 0.152: v14.48,18.75 16.61,16.61 17.68,16.61 Y3.1
N$18  (via drill 0.35)
  Top 0.152: v24.99,29.72 24.99,28.8 D3.C
  Bottom 0.152: v24.99,29.72 24.99,28.96 25.3,28.65 R15.1
N$20  (via drill 0.35)
  Top 0.152: v14.48,19.66 12.5,19.66 U4.5
  Bottom 0.152: v14.48,19.66 17.07,19.66 17.68,19.05 Y3.3
NRST  (via drill 0.35)
  Top 0.152: S1.3 2.9,13.11 2.9,9.14 S1.2 2.9,8.99 3.05,8.84 v3.96,8.84 | v10.97,18.75 12.34,18.75 U4.7 | v28.96,8.69 v31.09,6.55
  Bottom 0.152: v3.96,8.84 4.42,8.38 5.03,8.38 C17.2 5.18,8.38 6.25,8.38 R10.1 6.4,8.38 6.4,9.14 11.28,14.02 11.28,15.24 10.97,15.54 v10.97,18.75 13.87,21.64 16.76,21.64 19.05,19.36 19.05,19.05 21.49,16.61 21.49,11.58 24.69,8.38 27.13,8.38 27.43,8.69 v28.96,8.69 | v31.09,6.55 26.06,1.52 20.73,1.52 J2.5
RXD2  (via drill 0.35)
  Top 0.152: v13.56,13.11 14.17,12.5 U4.17 | v15.39,16.46 19.2,20.27 v19.2,21.03 | v27.28,23.47 27.28,28.8 22.4,33.68 14.33,33.68 14.02,33.38 10.67,33.38 v10.06,32.77
  Bottom 0.152: v13.56,13.11 13.56,14.63 v15.39,16.46 | v19.2,21.03 24.84,21.03 v27.28,23.47 | v10.06,32.77 8.99,32.77 7.32,34.44 P3.P$7
SDIO_CK  (via drill 0.35)
  Top 0.152: v29.72,23.47 28.19,23.47 27.13,22.4 v24.69,22.4 | v19.81,22.25 19.81,23.47 U4.53
  Bottom 0.152: v29.72,23.47 29.72,24.69 U7.P$5 | v24.69,22.4 21.79,22.4 21.03,21.64 20.42,21.64 v19.81,22.25
SDIO_CMD  (via drill 0.35)
  Top 0.152: v18.9,22.25 19.2,22.55 19.2,23.47 U4.54
  Bottom 0.152: v18.9,22.25 19.81,21.34 24.54,21.34 26.67,23.47 26.67,24.69 U7.P$2
SDIO_D0  (via drill 0.35)
  Top 0.152: v29.57,21.03 28.65,20.12 v26.21,20.12 | v24.99,17.07 24.69,17.07 24.54,17.22 23.62,17.22 U4.39
  Bottom 0.152: v29.57,21.03 31.24,22.71 31.24,24.69 U7.P$6 | v26.21,20.12 24.99,18.9 v24.99,17.07
SDIO_D1  (via drill 0.35)
  Top 0.152: v32.77,13.87 34.29,12.34 34.29,10.52 33.98,10.21 32.31,10.21 31.39,11.12 31.39,12.8 28.04,16.15 26.82,16.15 25.3,17.68 23.62,17.68 U4.40
  Bottom 0.152: v32.77,13.87 32.77,24.69 U7.P$7
SDIO_D2  (via drill 0.35)
  Top 0.152: v22.55,24.38 22.25,24.38 21.95,24.69 21.03,24.69 20.73,24.38 20.73,23.62 U4.51
  Bottom 0.152: v22.55,24.38 22.86,24.69 23.62,24.69 U7.P$4
SDIO_D3  (via drill 0.35)
  Top 0.152: v22.86,26.82 22.86,25.3 22.55,24.99 20.73,24.99 20.27,24.54 20.27,23.62 U4.52
  Bottom 0.152: v22.86,26.82 23.16,26.82 25.15,24.84 U7.P$3
SPI1_MISO  (via drill 0.35)
  Top 0.152: v5.03,11.73 6.55,10.21 12.65,10.21 v12.8,10.06 | v16.76,10.97 16.76,12.34 U4.22
  Bottom 0.152: v5.03,11.73 4.42,12.34 4.42,13.56 4.88,14.02 5.33,14.02 J3.7 | v12.8,10.06 15.85,10.06 v16.76,10.97
SPI1_MOSI  (via drill 0.35)
  Top 0.152: v17.98,10.97 17.68,11.28 17.53,11.28 17.22,11.58 17.22,12.34 U4.23
  Bottom 0.152: v17.98,10.97 19.36,9.6 19.36,7.77 19.2,7.62 16.92,7.62 16.61,7.32 16.61,7.01 14.63,5.03 8.84,5.03 8.38,5.49 8.38,6.1 6.86,7.62 4.27,7.62 3.35,8.53 3.35,9.14 3.66,9.45 3.81,9.45 6.4,12.04 6.4,17.98 5.94,18.44 5.49,18.44 J3.3
SPI1_SCK  (via drill 0.35)
  Top 0.152: v3.81,22.55 5.49,22.55 6.55,21.49 6.55,16.31 9.91,12.95 11.43,12.95 14.33,10.06 15.24,10.06 16.15,10.97 16.15,12.34 U4.21
  Bottom 0.152: v3.81,22.55 1.52,20.27 1.52,15.24 1.83,14.94 2.44,14.94 3.66,16.15 5.33,16.15 J3.5
SPI1_SS  (via drill 0.35)
  Top 0.152: v9.45,14.63 10.82,13.26 11.58,13.26 14.48,10.36 15.09,10.36 15.7,10.97 15.7,12.34 U4.20
  Bottom 0.152: v9.45,14.63 9.45,18.29 7.77,19.96 7.16,19.96 6.86,19.66 5.49,19.66 J3.2
SPI2_MISO  (via drill 0.35)
  Top 0.152: v12.95,26.06 12.95,26.82 15.7,29.57 15.7,31.39 U5.11 | v21.64,17.37 21.64,16.31 22.71,15.24 23.47,15.24 U4.35
  Bottom 0.152: v21.64,17.37 v12.95,26.06
SPI2_MOSI  (via drill 0.35)
  Top 0.152: v18.29,33.07 17.07,31.85 17.07,31.55 U5.9 | v27.43,30.94 27.43,29.11 33.53,23.01 33.53,13.56 34.59,12.5 34.59,10.36 34.14,9.91 29.72,9.91 24.69,14.94 24.69,15.54 24.54,15.7 23.62,15.7 U4.36
  Bottom 0.152: v18.29,33.07 20.42,33.07 22.55,30.94 v27.43,30.94
SPI2_SCK  (via drill 0.35)
  Top 0.152: v16.76,32.46 16.46,32.16 16.46,31.55 U5.10 | v33.83,8.99 30.94,8.99 30.33,9.6 29.11,9.6 24.69,14.02 24.69,14.48 24.54,14.63 23.62,14.63 U4.34
  Bottom 0.152: v16.76,32.46 20.57,32.46 22.4,30.63 26.82,30.63 32,25.45 32,13.41 33.83,11.58 v33.83,8.99
SPI2_SS  (via drill 0.35)
  Top 0.152: v17.68,30.02 17.68,31.39 U5.8 | v20.73,22.25 20.73,20.57 19.66,19.51 19.66,15.85 21.18,14.33 23.47,14.33 U4.33
  Bottom 0.152: v17.68,30.02 18.59,29.11 18.75,29.11 19.05,28.8 19.05,23.93 v20.73,22.25
SWCLK  (via drill 0.35)
  Top 0.152: v20.27,16.31 20.27,19.66 21.64,21.03 21.64,23.47 U4.49
  Bottom 0.152: v20.27,16.31 19.2,15.24 19.2,12.19 21.03,10.36 21.03,3.2 19.36,1.52 J2.4
SWDIO  (via drill 0.35)
  Top 0.152: v22.25,20.27 22.71,20.73 23.47,20.73 U4.46 | v23.47,12.04 23.47,7.47 v23.32,7.32 | v21.49,2.29 21.03,2.29 20.88,2.44 19.05,2.44 18.14,1.52 J2.3
  Bottom 0.152: v22.25,20.27 22.25,13.26 v23.47,12.04 | v23.32,7.32 23.32,4.88 21.49,3.05 v21.49,2.29
TXD2  (via drill 0.35)
  Top 0.152: v10.67,14.94 11.28,14.33 12.34,14.33 U4.16 | v9.45,22.86 8.84,23.47 8.84,25.45 9.91,26.52 9.91,31.7 v10.06,31.85
  Bottom 0.152: v10.67,14.94 10.67,18.14 9.45,19.36 v9.45,22.86 | v10.06,31.85 10.67,32.46 10.67,33.07 10.06,33.68 9.3,33.68 8.53,34.44 P3.P$6
USB_DM
  Top 0.152: R1.1 28.35,17.83 30.48,17.83 30.94,18.29 31.7,18.29 P1.2
USB_DP
  Top 0.152: P1.3 31.09,19.05 30.33,19.81 27.89,19.81 27.13,19.05 R2.1
V_SW2
  Top 0.152: U6.10 8.99,16.92 10.21,16.92 11.43,18.14 12.34,18.14 U4.8
V_SW3
  Top 0.152: U6.9 8.99,16.31 10.06,16.31 11.43,17.68 12.34,17.68 U4.9
VIDEO_IN  (via drill 0.35)
  Top 0.152: v2.44,8.08 4.12,8.08 v5.94,9.91 | v7.47,19.36 8.08,19.96 8.84,19.96 U6.15 8.99,20.12 v10.52,20.12 | v15.09,32.46 14.78,32.46 14.48,32.16 13.41,32.16 13.26,32 v13.26,28.04
  Bottom 0.152: v2.44,8.08 3.05,7.47 3.05,5.18 R8.2 | v5.94,9.91 5.94,11.12 7.47,12.65 v7.47,19.36 | 13.26,27.74 9.3,27.74 8.53,26.98 8.53,26.36 9.45,25.45 12.19,25.45 12.65,24.99 12.65,22.25 v10.52,20.12 | 13.26,27.74 16.46,27.74 17.07,28.35 18.14,28.35 C10.2 | v15.09,32.46 14.78,32.16 13.87,32.16 12.34,33.68 12.34,34.44 P3.P$3 | 13.26,27.74 v13.26,28.04
VIDEO_IN1
  Top 0.152: U6.2 3.2,20.12 2.59,20.12 2.29,20.42 2.29,21.18 3.2,22.1 3.2,24.08 6.4,27.28 6.4,29.41 7.32,30.33 7.47,30.33 9.45,32.31 9.45,33.07 10.06,33.68 13.87,33.68 14.63,34.44 P3.P$1
VIDEO_IN2  (via drill 0.35)
  Top 0.152: v5.49,21.64 4.72,20.88 3.35,20.88 U6.1 | v9.45,23.93 9.45,25.6 11.89,28.04 11.89,32.16 12.5,32.77 v14.17,32.77
  Bottom 0.152: v5.49,21.64 7.16,21.64 v9.45,23.93 | v14.17,32.77 14.17,33.53 13.56,34.14 13.56,34.44 P3.P$2
VIDEO_O  (via drill 0.35)
  Top 0.152: v10.97,21.49 11.12,21.34 11.12,19.81 10.36,19.05 10.36,18.9 9.6,18.14 8.99,18.14 U6.12 | v10.67,23.01 10.67,26.36 12.65,28.35 v12.65,31.39
  Bottom 0.152: 13.41,32.16 11.12,34.44 P3.P$4 | 13.41,32.16 13.72,31.85 16.76,31.85 20.12,28.5 20.27,28.5 20.57,28.19 R6.2 | v10.97,21.49 10.97,22.71 v10.67,23.01 | 13.41,32.16 v12.65,31.39
VSYNC  (via drill 0.35)
  Top 0.152: v13.26,24.84 14.48,24.84 14.94,25.3 14.94,25.6 U5.17 | v9.14,12.8 9.3,12.65 11.12,12.65 14.02,9.75 17.68,9.75 19.2,11.28 19.2,12.34 U4.27 | v8.69,22.25 8.69,23.16 8.53,23.32 8.53,26.06 v9.14,26.67
  Bottom 0.152: v13.26,24.84 12.34,25.76 12.34,26.36 | 12.34,26.36 13.26,27.28 14.48,27.28 14.63,27.13 R4.1 | v9.14,12.8 9.14,13.41 10.06,14.33 10.06,18.29 8.69,19.66 v8.69,22.25 | v9.14,26.67 12.04,26.67 12.34,26.36
XFB  (via drill 0.35)
  Top 0.152: v23.01,32.16 23.01,32.31 21.95,33.38 19.81,33.38 19.05,32.61 19.05,31.55 U5.6
  Bottom 0.152: v23.01,32.16 24.99,32.16 25.76,32.92 Y1.2
(copper drawn outside any net)
  shapes: Top area x2